# Altium schematic sheet Prepherals.SchDoc
size 152 x 152 mm; SheetNumber: 6; SheetTotal: 6
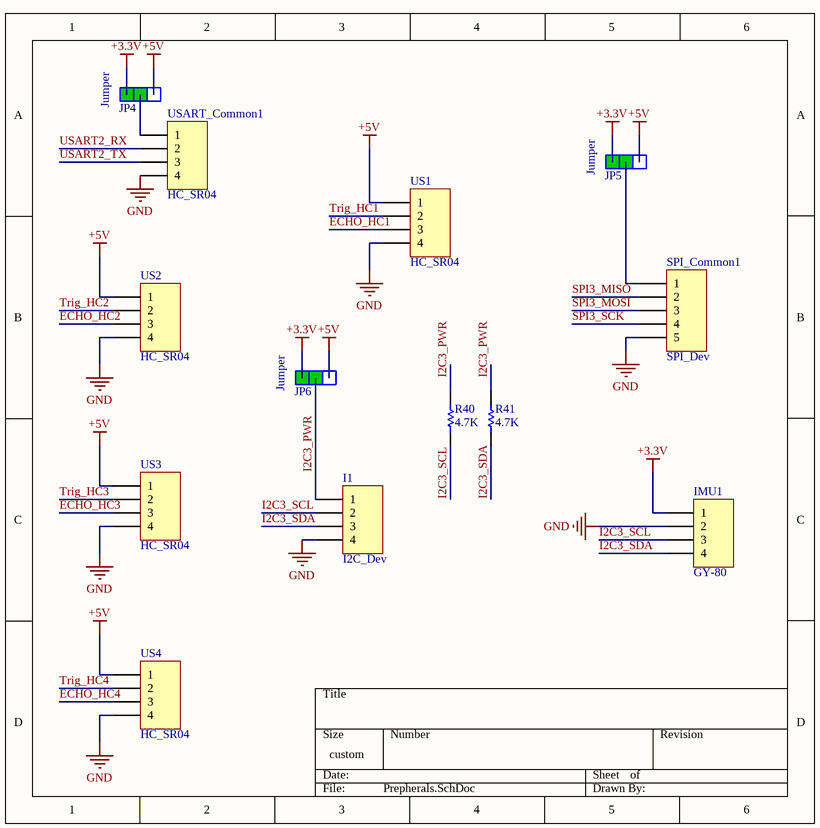
[diagram p0: Prepherals.SchDoc]

## Parts
I1  I2C_Dev  [XH Connector 4-Pin]
IMU1  GY-80  [XH Connector 4-Pin]
JP4  Jumper  [jumper selector]
JP5  Jumper  [jumper selector]
JP6  Jumper  [jumper selector]
R40  4.7K  [RESC3413X04N]
R41  4.7K  [RESC3413X04N]
SPI_Common1  SPI_Dev  [MO-Header 5]
US1  HC_SR04  [XH Connector 4-Pin]
US2  HC_SR04  [XH Connector 4-Pin]
US3  HC_SR04  [XH Connector 4-Pin]
US4  HC_SR04  [XH Connector 4-Pin]
USART_Common1  HC_SR04  [XH Connector 4-Pin]

## Nets
+3.3V: IMU1.1 JP4.1 JP5.1 JP6.1
+5V: JP4.3 JP5.3 JP6.3 US1.1 US2.1 US3.1 US4.1
GND: I1.4 IMU1.2 SPI_Common1.5 US1.4 US2.4 US3.4 US4.4 USART_Common1.4
ECHO_HC1: US1.3
ECHO_HC2: US2.3
ECHO_HC3: US3.3
ECHO_HC4: US4.3
I2C3_PWR: I1.1 JP6.2 R40.2 R41.2
I2C3_SCL: I1.2 IMU1.3 R40.1
I2C3_SDA: I1.3 IMU1.4 R41.1
SPI3_MISO: SPI_Common1.2
SPI3_MOSI: SPI_Common1.3
SPI3_SCK: SPI_Common1.4
Trig_HC1: US1.2
Trig_HC2: US2.2
Trig_HC3: US3.2
Trig_HC4: US4.2
USART2_RX: USART_Common1.2
USART2_TX: USART_Common1.3
NetJP4_2: JP4.2 USART_Common1.1
NetJP5_2: JP5.2 SPI_Common1.1

## Library data of the parts
I1 IMU1 US1-US4 USART_Common1 = Header 4 PIN Telecom.: Header, 4-Pin Telecom.; Designer: Abbas Basereh; Data: 16-12-2016; Link: *; Part. No: *
JP4-JP6 = Jumper Selector
R40 R41 = RES 0805 0.125W: RES 0805; Designer: Abbas Basereh; Desc.: RES SMD 0805; Data: 16-12-2016
SPI_Common1 = Header 5: Header, 5-Pin; LatestRevisionDate: 17-Jul-2002; LatestRevisionNote: Re-released for DXP Platform.; Publisher: Altium Limited